# Altium project AIgle_Carrier_Board.PrjPcb
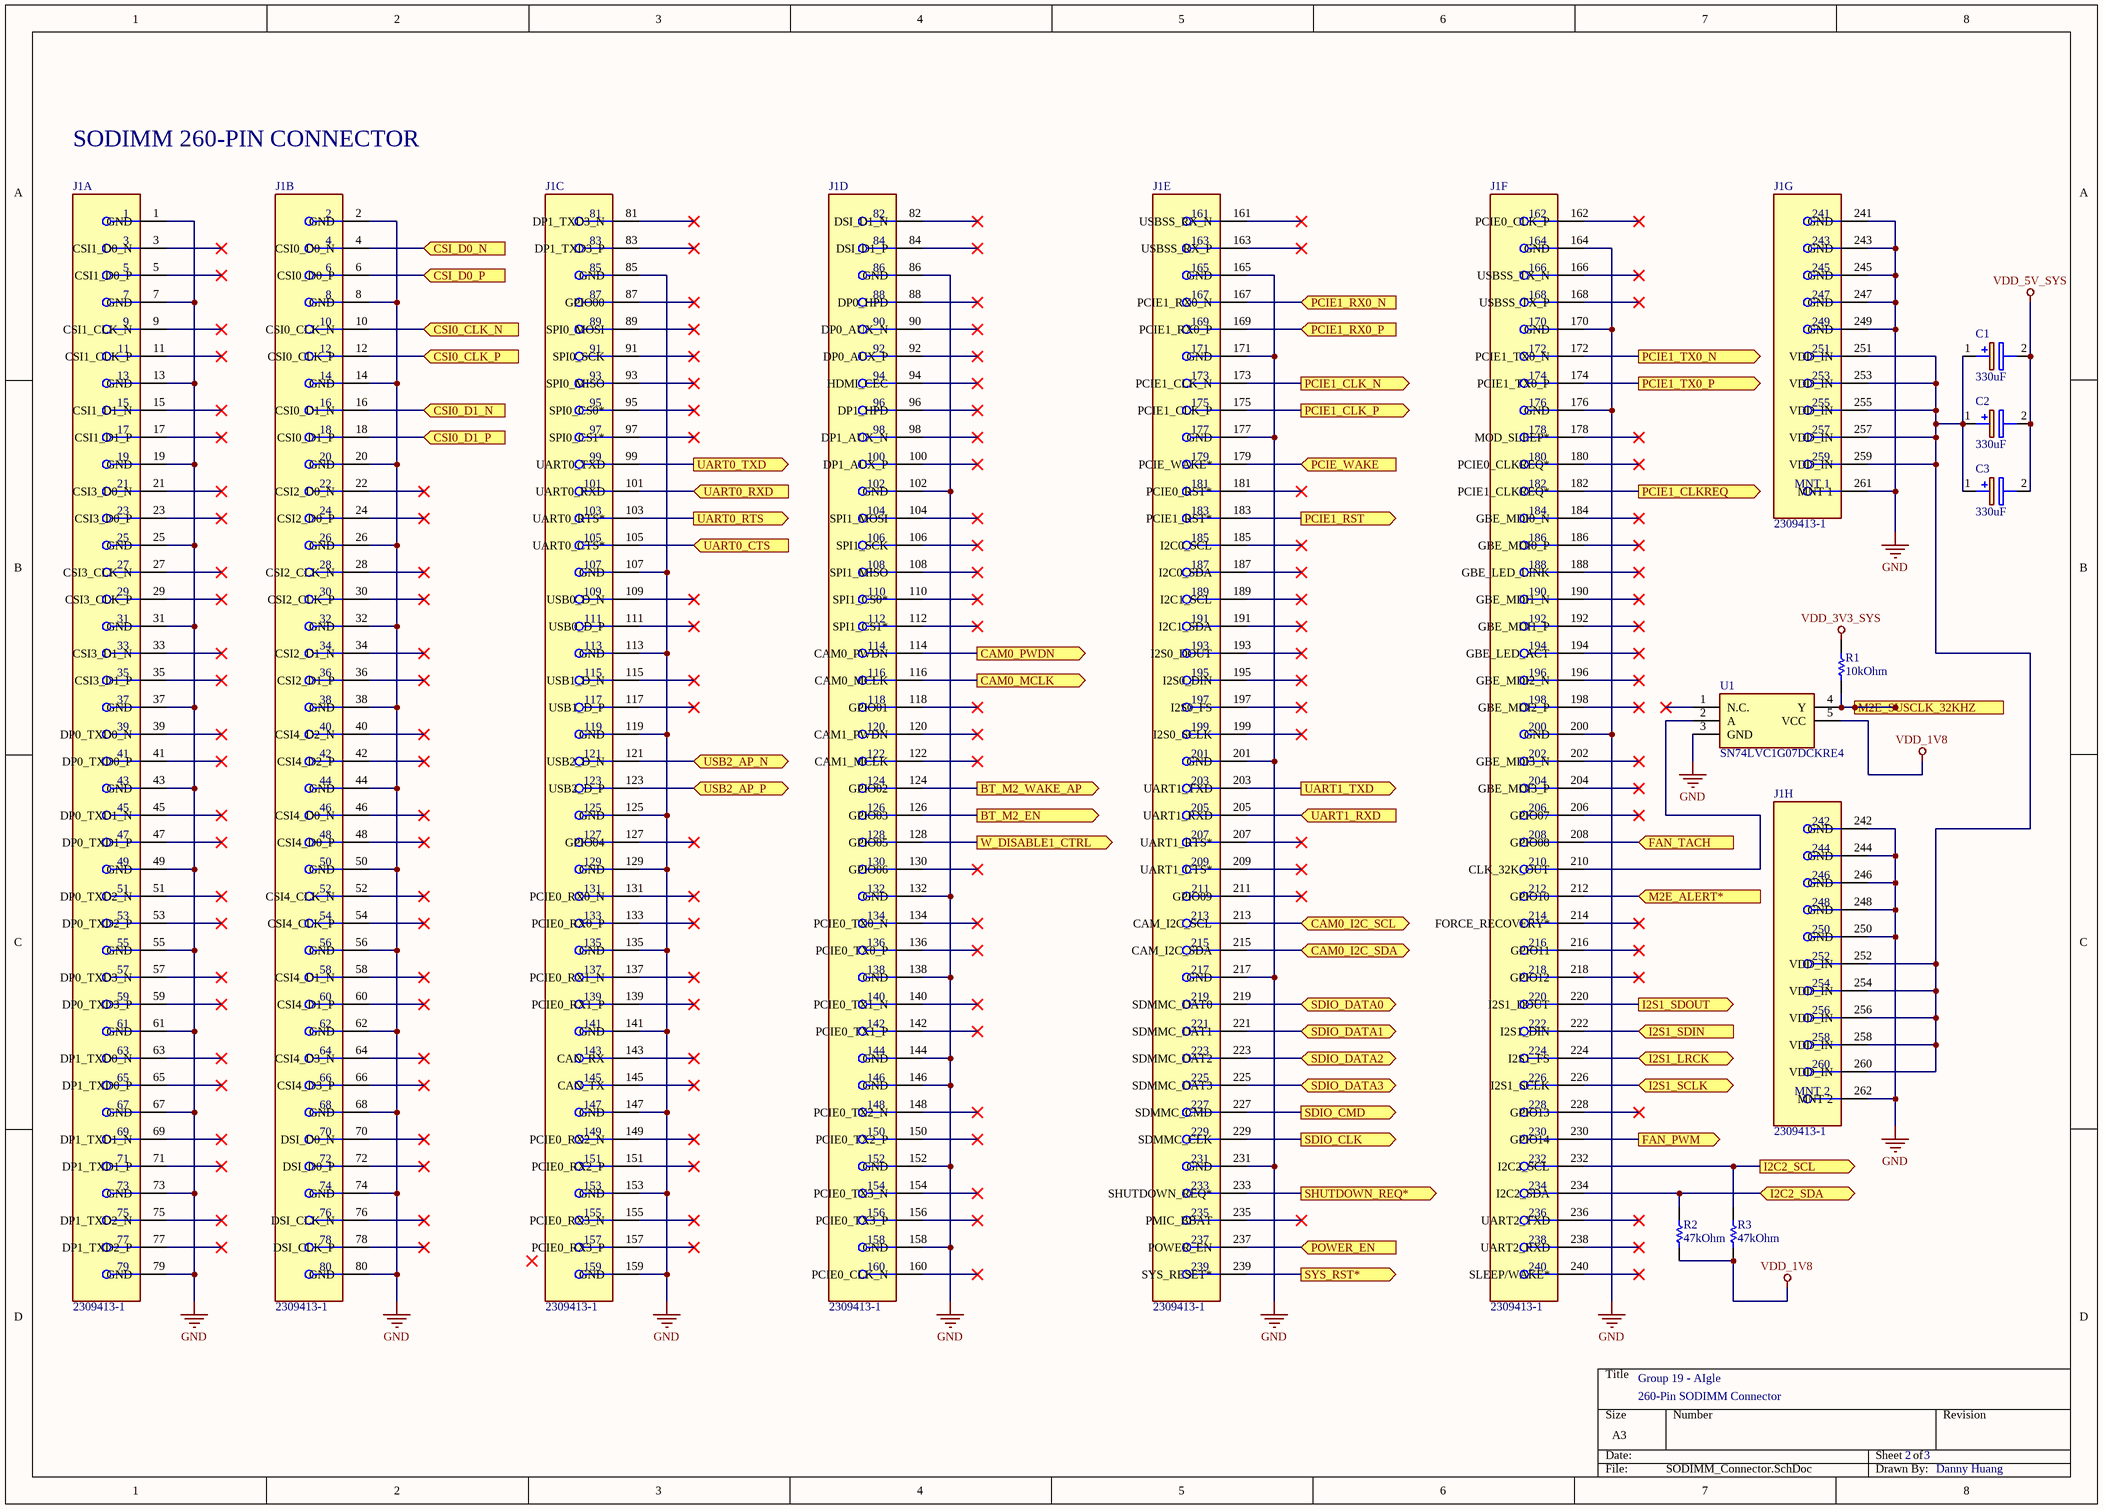
[diagram p0: SODIMM_Connector.SchDoc]
2 sheets, 48 parts. Net scope: flat (ports and power ports of the same name join across sheets).
Board file: AIgle_Carrier_Board.PcbDoc
Sheets:
  SODIMM_Connector.SchDoc
  IO_Connector.SchDoc

## Sheet SODIMM_Connector.SchDoc
size A3; CompanyName: Group 19 - AIgle; DrawnBy: Danny Huang; SheetNumber: 2; SheetTotal: 3

### Parts
C1  330uF  [CAPPM3528X210N]
C2  330uF  [CAPPM3528X210N]
C3  330uF  [CAPPM3528X210N]
J1  2309413-1  [FP-2309413-1-MFG]  (parts A,B,C,D,E,F,G,H of 8)
R1  10kOhm  [RESC1005X40X25NL05T05]
R2  47kOhm  [RESC1005X40X25LL05T05]
R3  47kOhm  [RESC1005X40X25LL05T05]
U1  SN74LVC1G07DCKRE4  [SOT65P210X110-5N]

### Ports
BT_M2_EN (out), BT_M2_WAKE_AP (out), CAM0_I2C_SCL (bidir), CAM0_I2C_SDA (bidir), CAM0_MCLK (out), CAM0_PWDN (out), CSI0_CLK_N (in), CSI0_CLK_P (in), CSI0_D1_N (in), CSI0_D1_P (in), CSI_D0_N (in), CSI_D0_P (in), FAN_PWM (out), FAN_TACH (in), I2C2_SCL (out), I2C2_SDA (bidir), I2S1_LRCK (bidir), I2S1_SCLK (bidir), I2S1_SDIN (in), I2S1_SDOUT (out), M2E_ALERT* (in), M2E_SUSCLK_32KHZ (out), PCIE1_CLK_N (out), PCIE1_CLK_P (out), PCIE1_CLKREQ (out), PCIE1_RST (out), PCIE1_RX0_N (in), PCIE1_RX0_P (in), PCIE1_TX0_N (out), PCIE1_TX0_P (out), PCIE_WAKE (in), POWER_EN (in), SDIO_CLK (out), SDIO_CMD (out), SDIO_DATA0 (bidir), SDIO_DATA1 (bidir), SDIO_DATA2 (bidir), SDIO_DATA3 (bidir), SHUTDOWN_REQ* (out), SYS_RST* (out), UART0_CTS (in), UART0_RTS (out), UART0_RXD (in), UART0_TXD (out), UART1_RXD (in), UART1_TXD (out), USB2_AP_N (bidir), USB2_AP_P (bidir), W_DISABLE1_CTRL (out)

### Nets
GND: J1.1(GND) J1.2(GND) J1.7(GND) J1.8(GND) J1.13(GND) J1.14(GND) J1.19(GND) J1.20(GND) J1.25(GND) J1.26(GND) J1.31(GND) J1.32(GND) J1.37(GND) J1.38(GND) J1.43(GND) J1.44(GND) J1.49(GND) J1.50(GND) J1.55(GND) J1.56(GND) J1.61(GND) J1.62(GND) J1.67(GND) J1.68(GND) J1.73(GND) J1.74(GND) J1.79(GND) J1.80(GND) J1.85(GND) J1.86(GND) J1.102(GND) J1.107(GND) J1.113(GND) J1.119(GND) J1.125(GND) J1.129(GND) J1.132(GND) J1.135(GND) J1.138(GND) J1.141(GND) J1.144(GND) J1.146(GND) J1.147(GND) J1.152(GND) J1.153(GND) J1.158(GND) J1.159(GND) J1.164(GND) J1.165(GND) J1.170(GND) J1.171(GND) J1.176(GND) J1.177(GND) J1.200(GND) J1.201(GND) J1.217(GND) J1.231(GND) J1.241(GND) J1.242(GND) J1.243(GND) J1.244(GND) J1.245(GND) J1.246(GND) J1.247(GND) J1.248(GND) J1.249(GND) J1.250(GND) J1.261(MNT_1) J1.262(MNT_2) U1.3(GND)
VDD_1V8: R2.1 R3.1 U1.5(VCC)
VDD_3V3_SYS: R1.2
VDD_5V_SYS: C1.2(-) C2.2(-) C3.2(-)
NetC1_1: C1.1(+) C2.1(+) C3.1(+) J1.251(VDD_IN) J1.252(VDD_IN) J1.253(VDD_IN) J1.254(VDD_IN) J1.255(VDD_IN) J1.256(VDD_IN) J1.257(VDD_IN) J1.258(VDD_IN) J1.259(VDD_IN) J1.260(VDD_IN)
NetC6_1: J1.174(PCIE1_TX0_P) ; port PCIE1_TX0_P
NetC8_1: J1.172(PCIE1_TX0_N) ; port PCIE1_TX0_N
NetJ1_4: J1.4(CSI0_D0_N) ; port CSI_D0_N
NetJ1_6: J1.6(CSI0_D0_P) ; port CSI_D0_P
NetJ1_10: J1.10(CSI0_CLK_N) ; port CSI0_CLK_N
NetJ1_12: J1.12(CSI0_CLK_P) ; port CSI0_CLK_P
NetJ1_16: J1.16(CSI0_D1_N) ; port CSI0_D1_N
NetJ1_18: J1.18(CSI0_D1_P) ; port CSI0_D1_P
NetJ1_99: J1.99(UART0_TXD) ; port UART0_TXD
NetJ1_101: J1.101(UART0_RXD) ; port UART0_RXD
NetJ1_103: J1.103(UART0_RTS*) ; port UART0_RTS
NetJ1_105: J1.105(UART0_CTS*) ; port UART0_CTS
NetJ1_114: J1.114(CAM0_PWDN) ; port CAM0_PWDN
NetJ1_116: J1.116(CAM0_MCLK) ; port CAM0_MCLK
NetJ1_121: J1.121(USB2_D_N) ; port USB2_AP_N
NetJ1_123: J1.123(USB2_D_P) ; port USB2_AP_P
NetJ1_124: J1.124(GPIO02) ; port BT_M2_WAKE_AP
NetJ1_126: J1.126(GPIO03) ; port BT_M2_EN
NetJ1_128: J1.128(GPIO05) ; port W_DISABLE1_CTRL
NetJ1_167: J1.167(PCIE1_RX0_N) ; port PCIE1_RX0_N
NetJ1_169: J1.169(PCIE1_RX0_P) ; port PCIE1_RX0_P
NetJ1_173: J1.173(PCIE1_CLK_N) ; port PCIE1_CLK_N
NetJ1_175: J1.175(PCIE1_CLK_P) ; port PCIE1_CLK_P
NetJ1_179: J1.179(PCIE_WAKE*) ; port PCIE_WAKE
NetJ1_182: J1.182(PCIE1_CLKREQ*) ; port PCIE1_CLKREQ
NetJ1_183: J1.183(PCIE1_RST*) ; port PCIE1_RST
NetJ1_203: J1.203(UART1_TXD) ; port UART1_TXD
NetJ1_205: J1.205(UART1_RXD) ; port UART1_RXD
NetJ1_208: J1.208(GPIO08) ; port FAN_TACH
NetJ1_210: J1.210(CLK_32K_OUT) U1.2(A)
NetJ1_212: J1.212(GPIO10) ; port M2E_ALERT*
NetJ1_213: J1.213(CAM_I2C_SCL) ; port CAM0_I2C_SCL
NetJ1_215: J1.215(CAM_I2C_SDA) ; port CAM0_I2C_SDA
NetJ1_219: J1.219(SDMMC_DAT0) ; port SDIO_DATA0
NetJ1_220: J1.220(I2S1_DOUT) ; port I2S1_SDOUT
NetJ1_221: J1.221(SDMMC_DAT1) ; port SDIO_DATA1
NetJ1_222: J1.222(I2S1_DIN) ; port I2S1_SDIN
NetJ1_223: J1.223(SDMMC_DAT2) ; port SDIO_DATA2
NetJ1_224: J1.224(I2S1_FS) ; port I2S1_LRCK
NetJ1_225: J1.225(SDMMC_DAT3) ; port SDIO_DATA3
NetJ1_226: J1.226(I2S1_SCLK) ; port I2S1_SCLK
NetJ1_227: J1.227(SDMMC_CMD) ; port SDIO_CMD
NetJ1_229: J1.229(SDMMC_CLK) ; port SDIO_CLK
NetJ1_230: J1.230(GPIO14) ; port FAN_PWM
NetJ1_232: J1.232(I2C2_SCL) R3.2 ; port I2C2_SCL
NetJ1_233: J1.233(SHUTDOWN_REQ*) ; port SHUTDOWN_REQ*
NetJ1_234: J1.234(I2C2_SDA) R2.2 ; port I2C2_SDA
NetJ1_237: J1.237(POWER_EN) ; port POWER_EN
NetJ1_239: J1.239(SYS_RESET*) ; port SYS_RST*
NetJ3_50: R1.1 U1.4(Y) ; port M2E_SUSCLK_32KHZ

Not connected (* = marked no-connect by the designer): J1 3(CSI1_D0_N)* 5(CSI1_D0_P)* 9(CSI1_CLK_N)* 11(CSI1_CLK_P)* 15(CSI1_D1_N)* 17(CSI1_D1_P)* 21(CSI3_D0_N)* 22(CSI2_D0_N)* 23(CSI3_D0_P)* 24(CSI2_D0_P)* 27(CSI3_CLK_N)* 28(CSI2_CLK_N)* 29(CSI3_CLK_P)* 30(CSI2_CLK_P)* 33(CSI3_D1_N)* 34(CSI2_D1_N)* 35(CSI3_D1_P)* 36(CSI2_D1_P)* 39(DP0_TXD0_N)* 40(CSI4_D2_N)* 41(DP0_TXD0_P)* 42(CSI4_D2_P)* 45(DP0_TXD1_N)* 46(CSI4_D0_N)* 47(DP0_TXD1_P)* 48(CSI4_D0_P)* 51(DP0_TXD2_N)* 52(CSI4_CLK_N)* 53(DP0_TXD2_P)* 54(CSI4_CLK_P)* 57(DP0_TXD3_N)* 58(CSI4_D1_N)* 59(DP0_TXD3_P)* 60(CSI4_D1_P)* 63(DP1_TXD0_N)* 64(CSI4_D3_N)* 65(DP1_TXD0_P)* 66(CSI4_D3_P)* 69(DP1_TXD1_N)* 70(DSI_D0_N)* 71(DP1_TXD1_P)* 72(DSI_D0_P)* 75(DP1_TXD2_N)* 76(DSI_CLK_N)* 77(DP1_TXD2_P)* 78(DSI_CLK_P)* 81(DP1_TXD3_N)* 82(DSI_D1_N)* 83(DP1_TXD3_P)* 84(DSI_D1_P)* 87(GPIO00)* 88(DP0_HPD)* 89(SPI0_MOSI)* 90(DP0_AUX_N)* 91(SPI0_SCK)* 92(DP0_AUX_P)* 93(SPI0_MISO)* 94(HDMI_CEC)* 95(SPI0_CS0*)* 96(DP1_HPD)* 97(SPI0_CS1*)* 98(DP1_AUX_N)* 100(DP1_AUX_P)* 104(SPI1_MOSI)* 106(SPI1_SCK)* 108(SPI1_MISO)* 109(USB0_D_N)* 110(SPI1_CS0*)* 111(USB0_D_P)* 112(SPI1_CS1*)* 115(USB1_D_N)* 117(USB1_D_P)* 118(GPIO01)* 120(CAM1_PWDN)* 122(CAM1_MCLK)* 127(GPIO04)* 130(GPIO06)* 131(PCIE0_RX0_N)* 133(PCIE0_RX0_P)* 134(PCIE0_TX0_N)* 136(PCIE0_TX0_P)* 137(PCIE0_RX1_N)* 139(PCIE0_RX1_P)* 140(PCIE0_TX1_N)* 142(PCIE0_TX1_P)* 143(CAN_RX)* 145(CAN_TX)* 148(PCIE0_TX2_N)* 149(PCIE0_RX2_N)* 150(PCIE0_TX2_P)* 151(PCIE0_RX2_P)* 154(PCIE0_TX3_N)* 155(PCIE0_RX3_N)* 156(PCIE0_TX3_P)* 157(PCIE0_RX3_P)* 160(PCIE0_CLK_N)* 161(USBSS_RX_N)* 162(PCIE0_CLK_P)* 163(USBSS_RX_P)* 166(USBSS_TX_N)* 168(USBSS_TX_P)* 178(MOD_SLEEP*)* 180(PCIE0_CLKREQ*)* 181(PCIE0_RST*)* 184(GBE_MDI0_N)* 185(I2C0_SCL)* 186(GBE_MDI0_P)* 187(I2C0_SDA)* 188(GBE_LED_LINK)* 189(I2C1_SCL)* 190(GBE_MDI1_N)* 191(I2C1_SDA)* 192(GBE_MDI1_P)* 193(I2S0_DOUT)* 194(GBE_LED_ACT)* 195(I2S0_DIN)* 196(GBE_MDI2_N)* 197(I2S0_FS)* 198(GBE_MDI2_P)* 199(I2S0_SCLK)* 202(GBE_MDI3_N)* 204(GBE_MDI3_P)* 206(GPIO07)* 207(UART1_RTS*)* 209(UART1_CTS*)* 211(GPIO09)* 214(FORCE_RECOVERY*)* 216(GPIO11)* 218(GPIO12)* 228(GPIO13)* 235(PMIC_BBAT)* 236(UART2_TXD)* 238(UART2_RXD)* 240(SLEEP/WAKE*)*; U1 1(N.C.)*

### Notes on the sheet
- SODIMM 260-PIN CONNECTOR
- 260-Pin SODIMM Connector

### Library data of the parts
C1-C3 = T520B337M006ATE040: Capacitor Polarised; Manufacturer_Name: Kemet; Datasheet Link: http://componentsearchengine.com/Datasheets/2/T520B337M006ATE040.pdf; Height: 2.1mm; Manufacturer_Part_Number: T520B337M006ATE040; Arrow Part Number: T520B337M006ATE040; Arrow Price/Stock: https://www.arrow.com/en/products/t520b337m006ate040/kemet-corporation; Mouser Part Number: 80-T520B337M06ATE040; Mouser Price/Stock: https://www.mouser.com/Search/Refine.aspx?Keyword=80-T520B337M06ATE040
J1 = CMP-03356-000001-1: DDR4 SODIMM 260P 9.2H STD; Manufacturer: TE Connectivity; Voltage Rating: 25V; Current Rating: 0.5A; Is Female: yes; Pitch: 0.5mm; Memory Type: SDRAM,DDR; Conn Orientation: Horizontal; Number Of Contacts: 260; Temperature: -55°C to +85°C; Octopart: https://octopart.com/2309413-1-te+connectivity-84799194; Device Class L3: unset; Contact Material: Gold,Nickel; ComponentLink2URL: https://www.te.com/commerce/DocumentDelivery/DDEController?Action=showdoc&DocId=Specification+Or+Standard%7F108-115122%7FA1%7Fpdf%7FEnglish%7FENG_SS_108-115122_A1.pdf%7F2309413-1; Manufacturer Part Number: 2309413-1; ComponentLink2Description: Datasheet; Digikey Description: DDR4 SODIMM 260P 9.2H STD; Height: 18.8mm; Footprint Url: https://www.te.com/commerce/DocumentDelivery/DDEController?Action=showdoc&DocId=Customer+Drawing%7F2309413%7F4%7Fpdf%7FEnglish%7FENG_CD_2309413_4.pdf%7F2309413-1; Temperature Range Low: -55°C; Device Class L2: Memory Connectors; Temperature Range High: +85°C; RoHS: TRUE; Automotive: No; Device Class L1: Connectors; Mouser Description: Conn DDR4 DIMM Socket SKT 260 POS 0.5mm Solder RA SMD T/R; Category: Conn; Package: 0; Lead Free: Yes
R1 = CMP-2002-08136-1: Manufacturer: Vishay Dale; Part Number: CRCW040210K0JNED
R2 R3 = CMP-2002-00026-1: Manufacturer: Vishay Dale; Part Number: CRCW040247K0JNED
U1 = SN74LVC1G07DCKRE4: Integrated Circuit; Manufacturer_Name: Texas Instruments; Datasheet Link: http://www.ti.com/lit/ds/symlink/sn74lvc1g07.pdf; Height: 1.1mm; Manufacturer_Part_Number: SN74LVC1G07DCKRE4; Arrow Part Number: SN74LVC1G07DCKRE4; Arrow Price/Stock: https://www.arrow.com/en/products/sn74lvc1g07dckre4/texas-instruments; Mouser Part Number: 595-SN74LVC1G07DCKE4; Mouser Price/Stock: https://www.mouser.co.uk/ProductDetail/Texas-Instruments/SN74LVC1G07DCKRE4?qs=pajgIaoyDUhxFR39KLTAuA%3D%3D

## Sheet IO_Connector.SchDoc
size A3; CompanyName: Group 19 - AIgle; DrawnBy: Danny Huang; SheetNumber: 1; SheetTotal: 3
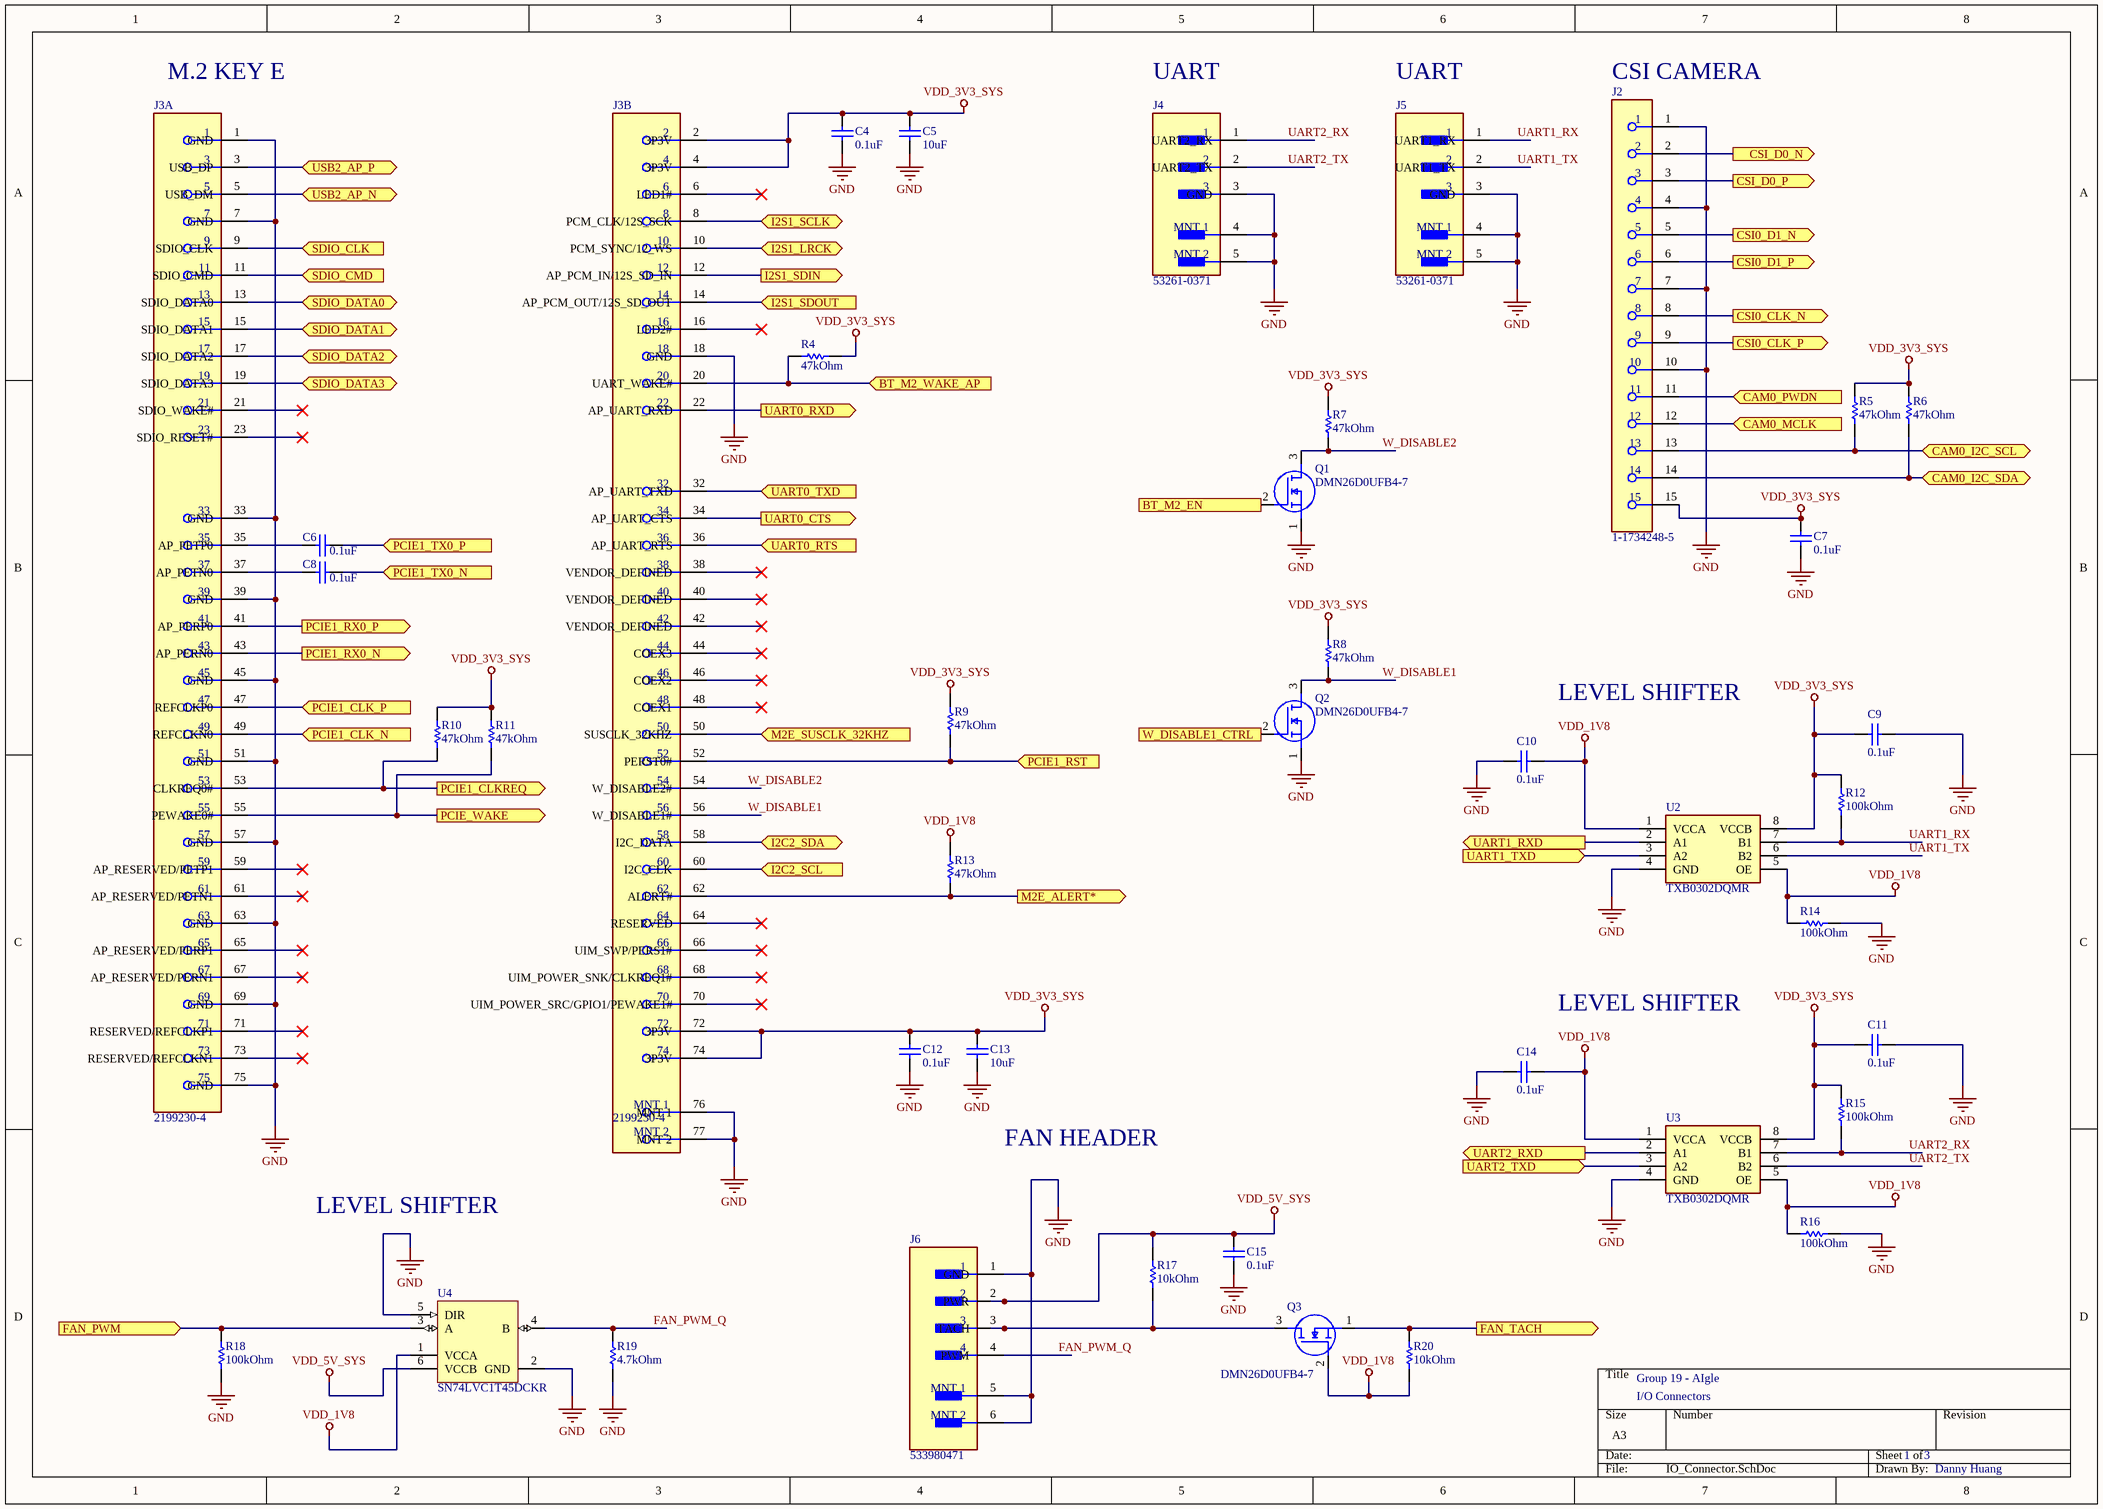
[diagram p1: IO_Connector.SchDoc]

### Parts
C4  0.1uF  [CAPC1005X55X30NL05T10]
C5  10uF  [CAPC1608X90X35NL10T15]
C6  0.1uF  [CAPC1005X55X30NL05T10]
C7  0.1uF  [CAPC1005X55X30NL05T10]
C8  0.1uF  [CAPC1005X55X30NL05T10]
C9  0.1uF  [CAPC1005X55X30NL05T10]
C10  0.1uF  [CAPC1005X55X30NL05T10]
C11  0.1uF  [CAPC1005X55X30NL05T10]
C12  0.1uF  [CAPC1005X55X30NL05T10]
C13  10uF  [CAPC1608X90X35NL10T15]
C14  0.1uF  [CAPC1005X55X30NL05T10]
C15  0.1uF  [CAPC1005X55X30NL05T10]
J2  1-1734248-5  [FP-1-1734248-5-MFG]
J3  2199230-4  [FP-2199230-4-MFG]  (parts A,B of 2)
J4  53261-0371  [FP-53261-0371-MFG]
J5  53261-0371  [FP-53261-0371-MFG]
J6  533980471  [FP-533980471-MFG]
Q1  DMN26D0UFB4-7  [DMN26D0UFB47]
Q2  DMN26D0UFB4-7  [DMN26D0UFB47]
Q3  DMN26D0UFB4-7  [DMN26D0UFB47]
R4  47kOhm  [RESC1005X40X25LL05T05]
R5  47kOhm  [RESC1005X40X25LL05T05]
R6  47kOhm  [RESC1005X40X25LL05T05]
R7  47kOhm  [RESC1005X40X25LL05T05]
R8  47kOhm  [RESC1005X40X25LL05T05]
R9  47kOhm  [RESC1005X40X25LL05T05]
R10  47kOhm  [RESC1005X40X25LL05T05]
R11  47kOhm  [RESC1005X40X25LL05T05]
R12  100kOhm  [RESC1005X40X25ML05T05]
R13  47kOhm  [RESC1005X40X25LL05T05]
R14  100kOhm  [RESC1005X40X25ML05T05]
R15  100kOhm  [RESC1005X40X25ML05T05]
R16  100kOhm  [RESC1005X40X25ML05T05]
R17  10kOhm  [RESC1005X40X25NL05T05]
R18  100kOhm  [RESC1005X40X25ML05T05]
R19  4.7kOhm  [RESC1005X40X25ML05T05]
R20  10kOhm  [RESC1005X40X25NL05T05]
U2  TXB0302DQMR  [SON40P120X180X40-8N]
U3  TXB0302DQMR  [SON40P120X180X40-8N]
U4  SN74LVC1T45DCKR  [DCK0006A_L]

### Ports
BT_M2_EN (in), BT_M2_WAKE_AP (in), CAM0_I2C_SCL (bidir), CAM0_I2C_SDA (bidir), CAM0_MCLK (in), CAM0_PWDN (in), CSI0_CLK_N (out), CSI0_CLK_P (out), CSI0_D1_N (out), CSI0_D1_P (out), CSI_D0_N (out), CSI_D0_P (out), FAN_PWM (in), FAN_TACH (out), I2C2_SCL (in), I2C2_SDA (bidir), I2S1_LRCK (bidir), I2S1_SCLK (bidir), I2S1_SDIN (out), I2S1_SDOUT (in), M2E_ALERT* (out), M2E_SUSCLK_32KHZ (in), PCIE1_CLK_N (in), PCIE1_CLK_P (in), PCIE1_CLKREQ (out), PCIE1_RST (in), PCIE1_RX0_N (out), PCIE1_RX0_P (out), PCIE1_TX0_N (in), PCIE1_TX0_P (in), PCIE_WAKE (out), SDIO_CLK (in), SDIO_CMD (in), SDIO_DATA0 (bidir), SDIO_DATA1 (bidir), SDIO_DATA2 (bidir), SDIO_DATA3 (bidir), UART0_CTS (out), UART0_RTS (in), UART0_RXD (out), UART0_TXD (in), UART1_RXD (out), UART1_TXD (in), UART2_RXD (out), UART2_TXD (in), USB2_AP_N (bidir), USB2_AP_P (bidir), W_DISABLE1_CTRL (in)

### Nets
GND: C4.1 C5.1 C7.1 C9.1 C10.2 C11.1 C12.1 C13.1 C14.2 C15.2 J2.1 J2.4 J2.7 J2.10 J3.1(GND) J3.7(GND) J3.18(GND) J3.33(GND) J3.39(GND) J3.45(GND) J3.51(GND) J3.57(GND) J3.63(GND) J3.69(GND) J3.75(GND) J3.76(MNT_1) J3.77(MNT_2) J4.3(GND) J4.4(MNT_1) J4.5(MNT_2) J5.3(GND) J5.4(MNT_1) J5.5(MNT_2) J6.1(GND) J6.5(MNT_1) J6.6(MNT_2) Q1.1(S) Q2.1(S) R14.1 R16.1 R18.2 R19.1 U2.4(GND) U3.4(GND) U4.2(GND) U4.5(DIR)
VDD_1V8: C10.1 C14.1 Q3.2(G) R13.2 R14.2 R16.2 R20.1 U2.1(VCCA) U2.5(OE) U3.1(VCCA) U3.5(OE) U4.1(VCCA)
VDD_3V3_SYS: C4.2 C5.2 C7.2 C9.2 C11.2 C12.2 C13.2 J2.15 J3.2(3P3V) J3.4(3P3V) J3.72(3P3V) J3.74(3P3V) R4.1 R5.2 R6.2 R7.2 R8.2 R9.2 R10.2 R11.2 R12.2 R15.2 U2.8(VCCB) U3.8(VCCB)
VDD_5V_SYS: C15.1 J6.2(PWR) R17.2 U4.6(VCCB)
FAN_PWM_Q: J6.4(PWM) R19.2 U4.4(B)
UART1_RX: J5.1(UART1_RX) R12.1 U2.7(B1)
UART1_TX: J5.2(UART1_TX) U2.6(B2)
UART2_RX: J4.1(UART2_RX) R15.1 U3.7(B1)
UART2_TX: J4.2(UART2_TX) U3.6(B2)
W_DISABLE1: J3.56(W_DISABLE1#) Q2.3(D) R8.1
W_DISABLE2: J3.54(W_DISABLE2#) Q1.3(D) R7.1
NetC6_1: C6.1 ; port PCIE1_TX0_P
NetC6_2: C6.2 J3.35(AP_PETP0)
NetC8_1: C8.1 ; port PCIE1_TX0_N
NetC8_2: C8.2 J3.37(AP_PETN0)
NetJ1_4: J2.2 ; port CSI_D0_N
NetJ1_6: J2.3 ; port CSI_D0_P
NetJ1_10: J2.8 ; port CSI0_CLK_N
NetJ1_12: J2.9 ; port CSI0_CLK_P
NetJ1_16: J2.5 ; port CSI0_D1_N
NetJ1_18: J2.6 ; port CSI0_D1_P
NetJ1_99: J3.32(AP_UART_TXD) ; port UART0_TXD
NetJ1_101: J3.22(AP_UART_RXD) ; port UART0_RXD
NetJ1_103: J3.36(AP_UART_RTS) ; port UART0_RTS
NetJ1_105: J3.34(AP_UART_CTS) ; port UART0_CTS
NetJ1_114: J2.11 ; port CAM0_PWDN
NetJ1_116: J2.12 ; port CAM0_MCLK
NetJ1_121: J3.5(USB_DM) ; port USB2_AP_N
NetJ1_123: J3.3(USB_DP) ; port USB2_AP_P
NetJ1_124: J3.20(UART_WAKE#) R4.2 ; port BT_M2_WAKE_AP
NetJ1_126: Q1.2(G) ; port BT_M2_EN
NetJ1_128: Q2.2(G) ; port W_DISABLE1_CTRL
NetJ1_167: J3.43(AP_PERN0) ; port PCIE1_RX0_N
NetJ1_169: J3.41(AP_PERP0) ; port PCIE1_RX0_P
NetJ1_173: J3.49(REFCLKN0) ; port PCIE1_CLK_N
NetJ1_175: J3.47(REFCLKP0) ; port PCIE1_CLK_P
NetJ1_179: J3.55(PEWAKE0#) R11.1 ; port PCIE_WAKE
NetJ1_182: J3.53(CLKREQ0#) R10.1 ; port PCIE1_CLKREQ
NetJ1_183: J3.52(PERST0#) R9.1 ; port PCIE1_RST
NetJ1_203: U2.3(A2) ; port UART1_TXD
NetJ1_205: U2.2(A1) ; port UART1_RXD
NetJ1_208: Q3.1(S) R20.2 ; port FAN_TACH
NetJ1_212: J3.62(ALERT#) R13.1 ; port M2E_ALERT*
NetJ1_213: J2.13 R5.1 ; port CAM0_I2C_SCL
NetJ1_215: J2.14 R6.1 ; port CAM0_I2C_SDA
NetJ1_219: J3.13(SDIO_DATA0) ; port SDIO_DATA0
NetJ1_220: J3.14(AP_PCM_OUT/12S_SD_OUT) ; port I2S1_SDOUT
NetJ1_221: J3.15(SDIO_DATA1) ; port SDIO_DATA1
NetJ1_222: J3.12(AP_PCM_IN/12S_SD_IN) ; port I2S1_SDIN
NetJ1_223: J3.17(SDIO_DATA2) ; port SDIO_DATA2
NetJ1_224: J3.10(PCM_SYNC/12_WS) ; port I2S1_LRCK
NetJ1_225: J3.19(SDIO_DATA3) ; port SDIO_DATA3
NetJ1_226: J3.8(PCM_CLK/12S_SCK) ; port I2S1_SCLK
NetJ1_227: J3.11(SDIO_CMD) ; port SDIO_CMD
NetJ1_229: J3.9(SDIO_CLK) ; port SDIO_CLK
NetJ1_230: R18.1 U4.3(A) ; port FAN_PWM
NetJ1_232: J3.60(I2C_CLK) ; port I2C2_SCL
NetJ1_234: J3.58(I2C_DATA) ; port I2C2_SDA
NetJ3_50: J3.50(SUSCLK_32KHZ) ; port M2E_SUSCLK_32KHZ
NetJ6_3: J6.3(TACH) Q3.3(D) R17.1
NetU3_2: U3.2(A1) ; port UART2_RXD
NetU3_3: U3.3(A2) ; port UART2_TXD

Not connected (* = marked no-connect by the designer): J3 6(LED1#)* 16(LED2#)* 21(SDIO_WAKE#)* 23(SDIO_RESET#)* 38(VENDOR_DEFINED)* 40(VENDOR_DEFINED)* 42(VENDOR_DEFINED)* 44(COEX3)* 46(COEX2)* 48(COEX1)* 59(AP_RESERVED/PETP1)* 61(AP_RESERVED/PETN1)* 64(RESERVED)* 65(AP_RESERVED/PERP1)* 66(UIM_SWP/PERS1#)* 67(AP_RESERVED/PERN1)* 68(UIM_POWER_SNK/CLKREQ1#)* 70(UIM_POWER_SRC/GPIO1/PEWAKE1#)* 71(RESERVED/REFCLKP1)* 73(RESERVED/REFCLKN1)*

### Notes on the sheet
- M.2 KEY E
- UART
- (near J2) CSI CAMERA
- LEVEL SHIFTER
- FAN HEADER
- I/O Connectors

### Library data of the parts
C4 C6-C12 C14 C15 = CMP-2008-03087-1: Manufacturer: Kemet; Part Number: C0402C104K9RACTU
C5 C13 = CMP-2006-02792-1: Part Number: GRM188R60J106ME47D; Manufacturer: Murata
J2 = CMP-03368-000001-1: CONN FPC VERT 15POS 1.00MM SMD; Manufacturer: TE; Conn Orientation: Vertical; Conn Gender: Female; Current Rating: 1A; Is Female: yes; Number Of Contacts: 15; Pitch: 1mm; Voltage Rating: 125V; ComponentLink2URL: https://www.te.com/commerce/DocumentDelivery/DDEController?Action=showdoc&DocId=Customer+Drawing%7F1734248%7FE1%7Fpdf%7FEnglish%7FENG_CD_1734248_E1__.pdf%7F1-1734248-5; Device Class L1: Connectors; Category: Conn; Package: 0; Lead Free: Yes; Digikey Description: CONN FPC VERT 15POS 1.00MM SMD; Height: 8mm; Manufacturer Part Number: 1-1734248-5; Temperature: -20°C to +85°C; Contact Material: Gold,Nickel; Device Class L3: unset; ComponentLink2Description: Datasheet; RoHS: TRUE; Temperature Range Low: -20°C; Octopart: https://octopart.com/1-1734248-5-te+connectivity-40620898; Device Class L2: FFC / FPC; Mouser Description: FFC & FPC Connectors 15P 1.0 FPC, Zip V/T SMT; Automotive: No; Temperature Range High: +85°C; Mounting Type: Surface Mount
J3 = CMP-03365-000002-1: CONN FEMALE 67POS 0.020 GOLD; Manufacturer: TE Connectivity; Conn Orientation: Right Angle; Pitch: 0.5mm; Number Of Contacts: 67; Voltage Rating: 50V; Is Female: yes; Current Rating: 0.5A; Lead Free: Yes; Temperature Range Low: -40°C; Device Class L3: unset; Package: 0; Manufacturer Part Number: 2199230-4; RoHS: TRUE; Digikey Description: CONN FEMALE 67POS 0.020 GOLD; Category: Conn; Device Class L1: Connectors; Temperature Range High: +80°C; ComponentLink2Description: Datasheet; ComponentLink2URL: https://www.te.com/commerce/DocumentDelivery/DDEController?Action=showdoc&DocId=Customer+Drawing%7F2199230%7FB3%7Fpdf%7FEnglish%7FENG_CD_2199230_B3.pdf%7F2199230-4; Mouser Description: PCI Express / PCI Connectors .5PITCH 4.2H KEY E EMBOSS NGFF MINICARD; Automotive: No; Conn Gender: Female; Height: 4.2mm; Device Class L2: Card Edge Connectors; Contact Material: Gold,Nickel; Number Of Rows: 2; Octopart: https://octopart.com/2199230-4-te+connectivity-46436156; Temperature: -40°C to +80°C
J4 J5 = CMP-04776-000071-1: CONN HEADER SMD R/A 3POS 1.25MM; Manufacturer: Molex; Number Of Contacts: 3; Conn Orientation: Right Angle; Current Rating: 1A; Voltage Rating: 125V; Conn Gender: Male; Category: Conn; Automotive: No; Footprint Url: https://www.molex.com/pdm_docs/sd/532610371_sd.pdf; Height: 3.6mm; Number Of Rows: 1; Temperature Range Low: -40°C; Package: 0; Octopart: https://octopart.com/53261-0371-molex-655314; ComponentLink2Description: Datasheet; Lead Free: Yes; Ambient Temperature Range Low: -40°C; Device Class L3: unset; Mouser Description: 1.25mm (.049") Pitch PicoBlade Header, Surface Mount, Right Angle, Lead-free, 3 Circuits; Digikey Description: CONN HEADER SMD R/A 3POS 1.25MM; Device Class L2: Headers and Wire Housings; Contact Material: Tin,Nickel; Manufacturer Part Number: 53261-0371; Ambient Temperature Range High: +105°C; ComponentLink2URL: https://www.molex.com/webdocs/datasheets/pdf/en-us/0532610371_PCB_HEADERS.pdf; Pitch: 1.25mm; Temperature: -40°C to +105°C; RoHS: TRUE; Device Class L1: Connectors; Temperature Range High: +105°C
J6 = CMP-04776-000105-1: CONN HEADER SMD 4POS 1.25MM; Manufacturer: Molex; Conn Gender: Male; Conn Orientation: Vertical; Standoff Height: 0.05mm; Number Of Contacts: 4; Current Rating: 1A; Voltage Rating: 125V; Package: 0; ComponentLink2Description: Datasheet; ComponentLink2URL: https://www.molex.com/pdm_docs/ps/PS-51021-024-001.pdf; Ambient Temperature Range Low: -40°C; Category: Conn; Automotive: No; Number Of Rows: 1; Device Class L3: unset; Ambient Temperature Range High: +105°C; Height: 5.1mm; Lead Free: Yes; Pitch: 1.25mm; Contact Material: Tin; Footprint Url: https://www.molex.com/pdm_docs/sd/533980471_sd.pdf; Octopart: https://octopart.com/53398-0471-molex-655296; Temperature Range Low: -40°C; Device Class L2: Headers and Wire Housings; Temperature: -40°C to +105°C; Digikey Description: CONN HEADER SMD 4POS 1.25MM; RoHS: TRUE; Manufacturer Part Number: 533980471; Device Class L1: Connectors; Temperature Range High: +105°C
Q1-Q3 = DMN26D0UFB4-7: MOSFET (N-Channel); Manufacturer_Name: Diodes Inc.; Datasheet Link: https://componentsearchengine.com/Datasheets/1/DMN26D0UFB4-7.pdf; Height: 0.4mm; Manufacturer_Part_Number: DMN26D0UFB4-7; Arrow Part Number: DMN26D0UFB4-7; Arrow Price/Stock: https://www.arrow.com/en/products/dmn26d0ufb4-7/diodes-incorporated; Mouser Part Number: 621-DMN26D0UFB4-7; Mouser Price/Stock: https://www.mouser.co.uk/ProductDetail/Diodes-Incorporated/DMN26D0UFB4-7?qs=GWgl%252BsiMZr%252B4pznsTuF3iQ%3D%3D
R4-R11 R13 = CMP-2002-00026-1: as R2 on sheet SODIMM_Connector
R12 R14-R16 R18 = CMP-2002-08123-2: Chip Resistor, 100 KOhm, +/- 1%, 0.63 W, -55 to 155 degC, 0402 (1005 Metric), RoHS, Tape and Reel; Voltage Rating: 50 V; Type (Resistor): Thick Film; Power Rating: 63 mW; Case\Package: 0402; Mount: Surface Mount; Packaging: Tape and Reel; Weight: 2.3E-05 oz; PackageDescription: 2-Pin Surface Mount Device, Body 1 x 0.5 mm; ComponentLink1Description: Manufacturer URL; ComponentLink2Description: Datasheet; Min Operating Temperature: -55 degC; Width: 0.5 mm; Resistance: 100 kohm; REACH SVHC: Unknown; ComponentLink2URL: http://www.vishay.com/docs/20035/dcrcwe3.pdf; Package Quantity: 10000; Mounting Technology: Surface Mount; PackageReference: 0402; ComponentLink1URL: http://www.vishay.com/; Max Operating Temperature: 155 degC; Length: 1 mm; DatasheetVersion: 06/2012; Height: 0.35 mm; Case Code (Imperial): 0402; Pins: 2; Tolerance: 1%; Case Code (Metric): 1005; Radiation Hardening: No; RoHSCompliant: true
R17 R20 = CMP-2002-08136-1: as R1 on sheet SODIMM_Connector
R19 = CMP-2002-00053-1: Part Number: CRCW04024K70JNED; Manufacturer: Vishay BCcomponents
U2 U3 = TXB0302DQMR: Integrated Circuit; Manufacturer_Name: Texas Instruments; Datasheet Link: http://www.ti.com/lit/gpn/txb0302; Height: 0.4mm; Manufacturer_Part_Number: TXB0302DQMR; Arrow Part Number: TXB0302DQMR; Arrow Price/Stock: https://www.arrow.com/en/products/txb0302dqmr/texas-instruments; Mouser Part Number: 595-TXB0302DQMR; Mouser Price/Stock: https://www.mouser.co.uk/ProductDetail/Texas-Instruments/TXB0302DQMR?qs=5771e39Rz9HEpqtrmqNQ0Q%3D%3D
U4 = CMP-0859-00452-3: Single-Bit Dual-Supply Bus Transceiver with Configurable Voltage Translation and 3-State Outputs, DCK0006A, LARGE T&R; Manufacturer: Texas Instruments; Rating: Catalog; Output Type: CMOS; Technology Family: LVC; Voltage(Nom)(V): 1.8,2.5,3.3,5; VCC(Max)(V): 5.5; 3-State Output: Yes; Bits(#): 1; F @ Nom Voltage(Max)(Mhz): 150; VCC(Min)(V): 1.65; ICC @ Nom Voltage(Max)(mA): 0.004; Schmitt Trigger: No; Input Type: CMOS/TTL; tpd @ Nom Voltage(Max)(ns): 15.5,8,5.8,4.4; Logic: True; Output Drive (IOL/IOH)(Max)(mA): 32/-32; Sub-Family: Dual Supply Translator; PackageReference: DCK0006A; Generic Part Number: SN74LVC1T45; DatasheetVersion: SCES515K; Operating Temperature Range(C): -40 to 85

## Nets that join several sheets
GND: SODIMM_Connector (70 pins), IO_Connector (46 pins)
VDD_1V8: SODIMM_Connector (R2.1 R3.1 U1.5), IO_Connector (12 pins)
VDD_3V3_SYS: SODIMM_Connector (R1.2), IO_Connector (24 pins)
VDD_5V_SYS: SODIMM_Connector (C1.2 C2.2 C3.2), IO_Connector (C15.1 J6.2 R17.2 U4.6)
NetC6_1: SODIMM_Connector (J1.174), IO_Connector (C6.1)
NetC8_1: SODIMM_Connector (J1.172), IO_Connector (C8.1)
NetJ1_4: SODIMM_Connector (J1.4), IO_Connector (J2.2)
NetJ1_6: SODIMM_Connector (J1.6), IO_Connector (J2.3)
NetJ1_10: SODIMM_Connector (J1.10), IO_Connector (J2.8)
NetJ1_12: SODIMM_Connector (J1.12), IO_Connector (J2.9)
NetJ1_16: SODIMM_Connector (J1.16), IO_Connector (J2.5)
NetJ1_18: SODIMM_Connector (J1.18), IO_Connector (J2.6)
NetJ1_99: SODIMM_Connector (J1.99), IO_Connector (J3.32)
NetJ1_101: SODIMM_Connector (J1.101), IO_Connector (J3.22)
NetJ1_103: SODIMM_Connector (J1.103), IO_Connector (J3.36)
NetJ1_105: SODIMM_Connector (J1.105), IO_Connector (J3.34)
NetJ1_114: SODIMM_Connector (J1.114), IO_Connector (J2.11)
NetJ1_116: SODIMM_Connector (J1.116), IO_Connector (J2.12)
NetJ1_121: SODIMM_Connector (J1.121), IO_Connector (J3.5)
NetJ1_123: SODIMM_Connector (J1.123), IO_Connector (J3.3)
NetJ1_124: SODIMM_Connector (J1.124), IO_Connector (J3.20 R4.2)
NetJ1_126: SODIMM_Connector (J1.126), IO_Connector (Q1.2)
NetJ1_128: SODIMM_Connector (J1.128), IO_Connector (Q2.2)
NetJ1_167: SODIMM_Connector (J1.167), IO_Connector (J3.43)
NetJ1_169: SODIMM_Connector (J1.169), IO_Connector (J3.41)
NetJ1_173: SODIMM_Connector (J1.173), IO_Connector (J3.49)
NetJ1_175: SODIMM_Connector (J1.175), IO_Connector (J3.47)
NetJ1_179: SODIMM_Connector (J1.179), IO_Connector (J3.55 R11.1)
NetJ1_182: SODIMM_Connector (J1.182), IO_Connector (J3.53 R10.1)
NetJ1_183: SODIMM_Connector (J1.183), IO_Connector (J3.52 R9.1)
NetJ1_203: SODIMM_Connector (J1.203), IO_Connector (U2.3)
NetJ1_205: SODIMM_Connector (J1.205), IO_Connector (U2.2)
NetJ1_208: SODIMM_Connector (J1.208), IO_Connector (Q3.1 R20.2)
NetJ1_212: SODIMM_Connector (J1.212), IO_Connector (J3.62 R13.1)
NetJ1_213: SODIMM_Connector (J1.213), IO_Connector (J2.13 R5.1)
NetJ1_215: SODIMM_Connector (J1.215), IO_Connector (J2.14 R6.1)
NetJ1_219: SODIMM_Connector (J1.219), IO_Connector (J3.13)
NetJ1_220: SODIMM_Connector (J1.220), IO_Connector (J3.14)
NetJ1_221: SODIMM_Connector (J1.221), IO_Connector (J3.15)
NetJ1_222: SODIMM_Connector (J1.222), IO_Connector (J3.12)
NetJ1_223: SODIMM_Connector (J1.223), IO_Connector (J3.17)
NetJ1_224: SODIMM_Connector (J1.224), IO_Connector (J3.10)
NetJ1_225: SODIMM_Connector (J1.225), IO_Connector (J3.19)
NetJ1_226: SODIMM_Connector (J1.226), IO_Connector (J3.8)
NetJ1_227: SODIMM_Connector (J1.227), IO_Connector (J3.11)
NetJ1_229: SODIMM_Connector (J1.229), IO_Connector (J3.9)
NetJ1_230: SODIMM_Connector (J1.230), IO_Connector (R18.1 U4.3)
NetJ1_232: SODIMM_Connector (J1.232 R3.2), IO_Connector (J3.60)
NetJ1_234: SODIMM_Connector (J1.234 R2.2), IO_Connector (J3.58)
NetJ3_50: SODIMM_Connector (R1.1 U1.4), IO_Connector (J3.50)